# Altium schematic sheet 780-00055, rev1, Pg4, SCH, NRES Temp Meas, 8-Chan RTD .SchDoc
size B; PageSetup: Record=PageOptions|CenterHorizontal=True|CenterVertical=True|PrintScale=1.09|XCorrection=1.00|YCorrection=1.00|PrintKind=0|BorderSize=5000000|LeftOffset=0|BottomOffset=0|Orientation=2|PaperLength=1000|PaperWidth=1000|Scale=100|PaperSource=7|PrintQuality=-4|MediaType=1|DitherType=10|PaperKind=Ledger|PrintScaleMode=1
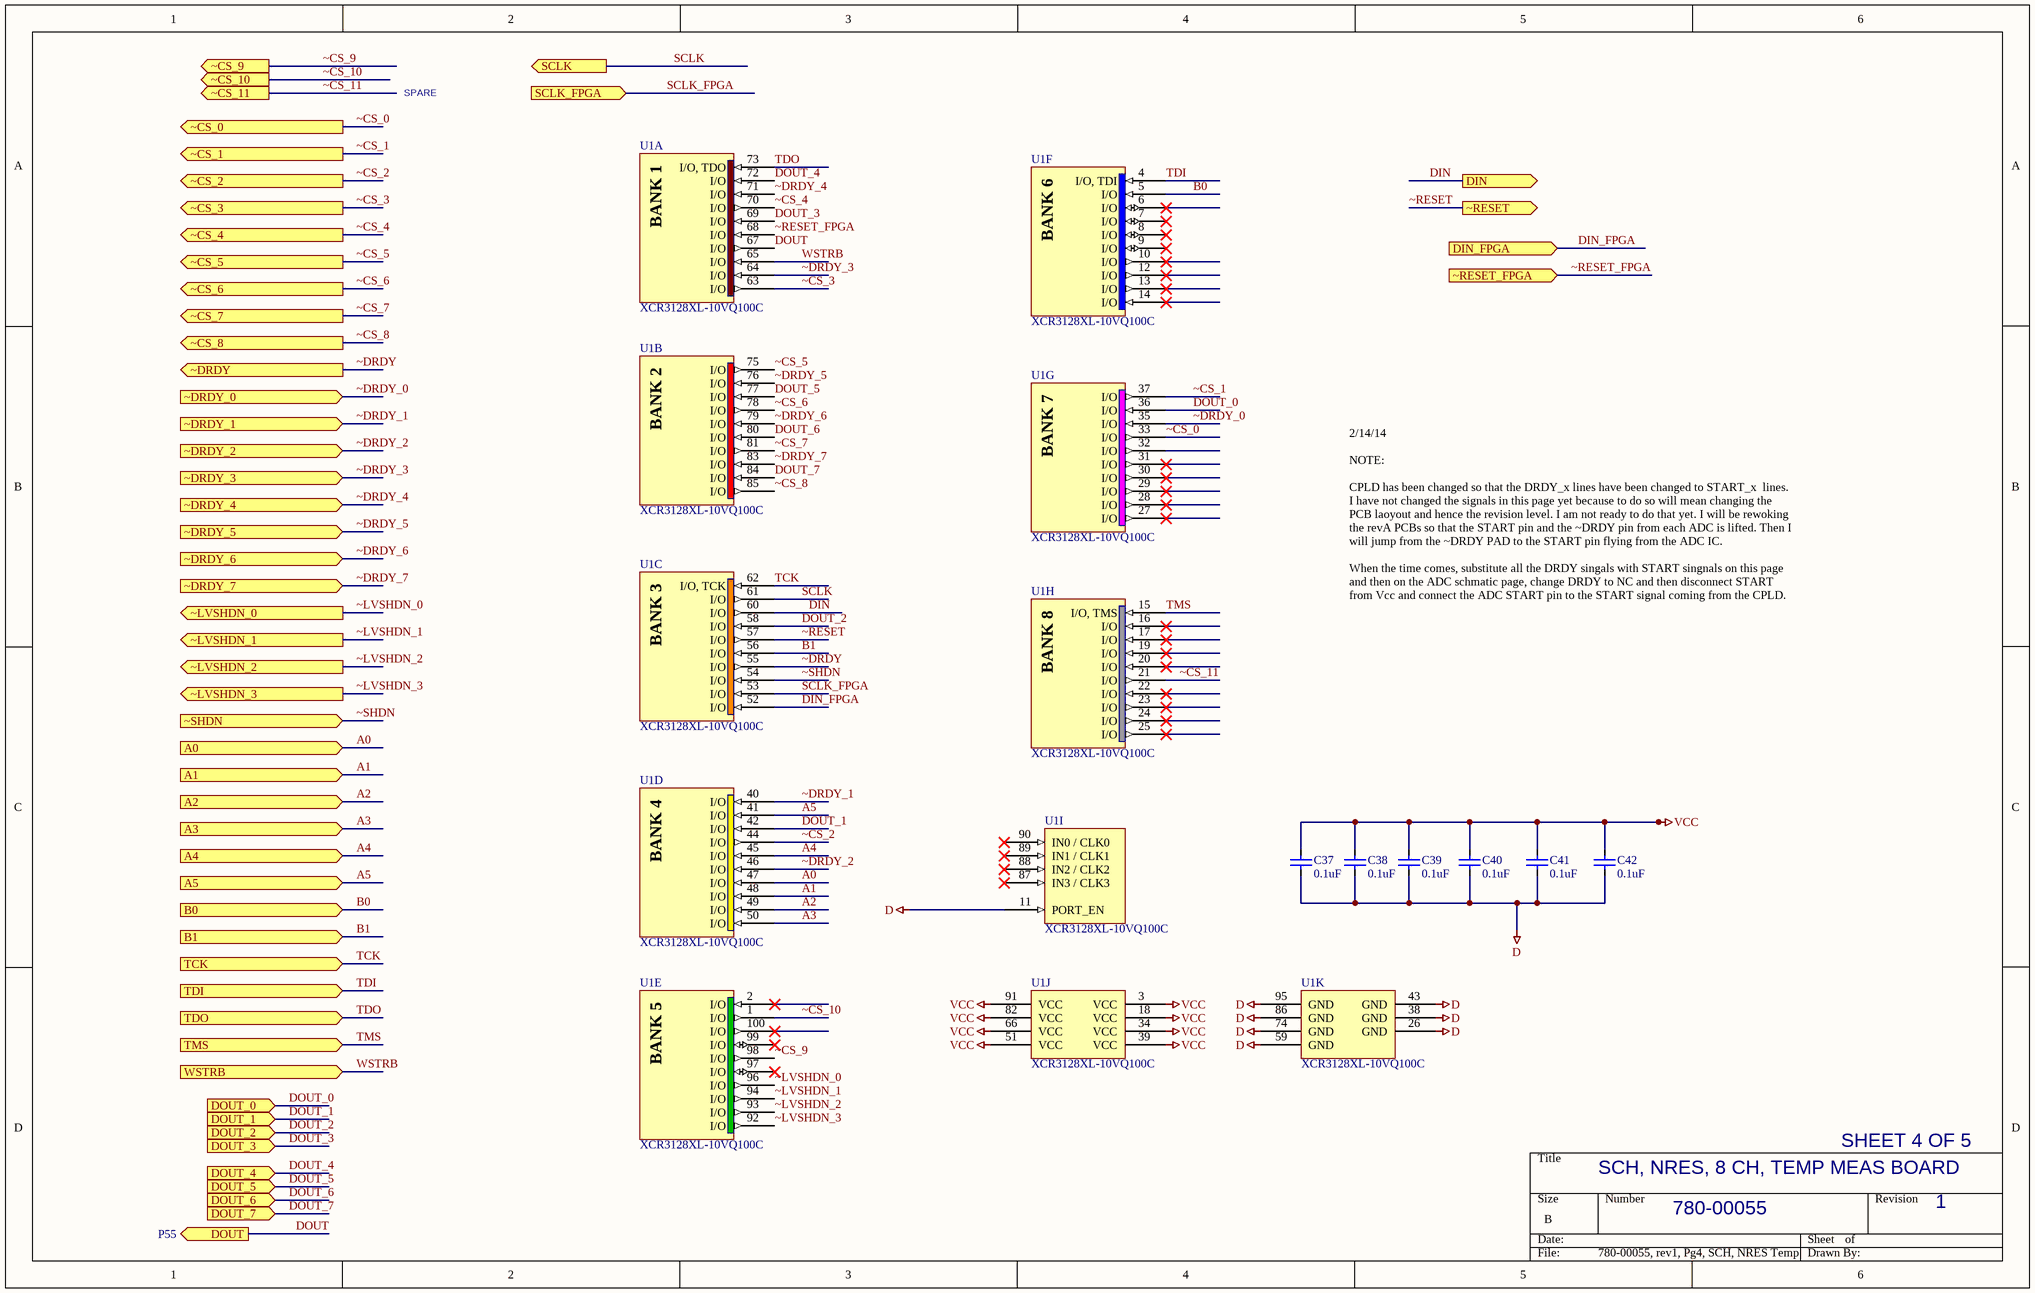
[diagram p0: 780-00055, rev1, Pg4, SCH, NRES Temp Meas, 8-Chan RTD .SchDoc]

## Parts
C37  value 0.1uF  [SMD_0805]  (hidden comment: Cap SMD)
C38  value 0.1uF  [SMD_0805]  (hidden comment: Cap SMD)
C39  value 0.1uF  [SMD_0805]  (hidden comment: Cap SMD)
C40  value 0.1uF  [SMD_0805]  (hidden comment: Cap SMD)
C41  value 0.1uF  [SMD_0805]  (hidden comment: Cap SMD)
C42  value 0.1uF  [SMD_0805]  (hidden comment: Cap SMD)
U1  XCR3128XL-10VQ100C  [VQ100_N]  (parts A,B,C,D,E,F,G,H,I,J,K of 11)

## Ports
A0 (in), A1 (in), A2 (in), A3 (in), A4 (in), A5 (in), B0 (in), B1 (in), DIN (out), DIN_FPGA (in), DOUT (out, see P55), DOUT_0 (in), DOUT_1 (in), DOUT_2 (in), DOUT_3 (in), DOUT_4 (in), DOUT_5 (in), DOUT_6 (in), DOUT_7 (in), SCLK (out), SCLK_FPGA (in), TCK (in), TDI (in), TDO (in), TMS (in), WSTRB (in), ~CS_0 (out), ~CS_1 (out), ~CS_2 (out), ~CS_3 (out), ~CS_4 (out), ~CS_5 (out), ~CS_6 (out), ~CS_7 (out), ~CS_8 (out), ~CS_9 (out), ~CS_10 (out), ~CS_11 (out), ~DRDY (out), ~DRDY_0 (in), ~DRDY_1 (in), ~DRDY_2 (in), ~DRDY_3 (in), ~DRDY_4 (in), ~DRDY_5 (in), ~DRDY_6 (in), ~DRDY_7 (in), ~LVSHDN_0 (out), ~LVSHDN_1 (out), ~LVSHDN_2 (out), ~LVSHDN_3 (out), ~RESET (out), ~RESET_FPGA (in), ~SHDN (in)

## Nets
D: C37.1 C38.1 C39.1 C40.1 C41.1 C42.1 U1.11(PORT_EN) U1.26(GND) U1.38(GND) U1.43(GND) U1.59(GND) U1.74(GND) U1.86(GND) U1.95(GND)
VCC: C37.2 C38.2 C39.2 C40.2 C41.2 C42.2 U1.3(VCC) U1.18(VCC) U1.34(VCC) U1.39(VCC) U1.51(VCC) U1.66(VCC) U1.82(VCC) U1.91(VCC)
A0: U1.47(I/O) ; port A0
A1: U1.48(I/O) ; port A1
A2: U1.49(I/O) ; port A2
A3: U1.50(I/O) ; port A3
A4: U1.45(I/O) ; port A4
A5: U1.41(I/O) ; port A5
B0: U1.5(I/O) ; port B0
B1: U1.56(I/O) ; port B1
DIN: U1.60(I/O) ; port DIN
DIN_FPGA: U1.52(I/O) ; port DIN_FPGA
DOUT: U1.67(I/O) ; port DOUT
DOUT_0: U1.36(I/O) ; port DOUT_0
DOUT_1: U1.42(I/O) ; port DOUT_1
DOUT_2: U1.58(I/O) ; port DOUT_2
DOUT_3: U1.69(I/O) ; port DOUT_3
DOUT_4: U1.72(I/O) ; port DOUT_4
DOUT_5: U1.77(I/O) ; port DOUT_5
DOUT_6: U1.80(I/O) ; port DOUT_6
DOUT_7: U1.84(I/O) ; port DOUT_7
SCLK: U1.61(I/O) ; port SCLK
SCLK_FPGA: U1.53(I/O) ; port SCLK_FPGA
TCK: U1.62(I/O,_TCK) ; port TCK
TDI: U1.4(I/O,_TDI) ; port TDI
TDO: U1.73(I/O,_TDO) ; port TDO
TMS: U1.15(I/O,_TMS) ; port TMS
WSTRB: U1.65(I/O) ; port WSTRB
~CS_0: U1.33(I/O) ; port ~CS_0
~CS_1: U1.37(I/O) ; port ~CS_1
~CS_2: U1.44(I/O) ; port ~CS_2
~CS_3: U1.63(I/O) ; port ~CS_3
~CS_4: U1.70(I/O) ; port ~CS_4
~CS_5: U1.75(I/O) ; port ~CS_5
~CS_6: U1.78(I/O) ; port ~CS_6
~CS_7: U1.81(I/O) ; port ~CS_7
~CS_8: U1.85(I/O) ; port ~CS_8
~CS_9: U1.98(I/O) ; port ~CS_9
~CS_10: U1.1(I/O) ; port ~CS_10
~CS_11: U1.21(I/O) ; port ~CS_11
~DRDY: U1.55(I/O) ; port ~DRDY
~DRDY_0: U1.35(I/O) ; port ~DRDY_0
~DRDY_1: U1.40(I/O) ; port ~DRDY_1
~DRDY_2: U1.46(I/O) ; port ~DRDY_2
~DRDY_3: U1.64(I/O) ; port ~DRDY_3
~DRDY_4: U1.71(I/O) ; port ~DRDY_4
~DRDY_5: U1.76(I/O) ; port ~DRDY_5
~DRDY_6: U1.79(I/O) ; port ~DRDY_6
~DRDY_7: U1.83(I/O) ; port ~DRDY_7
~LVSHDN_0: U1.96(I/O) ; port ~LVSHDN_0
~LVSHDN_1: U1.94(I/O) ; port ~LVSHDN_1
~LVSHDN_2: U1.93(I/O) ; port ~LVSHDN_2
~LVSHDN_3: U1.92(I/O) ; port ~LVSHDN_3
~RESET: U1.57(I/O) ; port ~RESET
~RESET_FPGA: U1.68(I/O) ; port ~RESET_FPGA
~SHDN: U1.54(I/O) ; port ~SHDN

Not connected (* = marked no-connect by the designer): U1 2(I/O)* 6(I/O)* 7(I/O)* 8(I/O)* 9(I/O)* 10(I/O)* 12(I/O)* 13(I/O)* 14(I/O)* 16(I/O)* 17(I/O)* 19(I/O)* 20(I/O)* 22(I/O)* 23(I/O)* 24(I/O)* 25(I/O)* 27(I/O)* 28(I/O)* 29(I/O)* 30(I/O)* 31(I/O)* 32(I/O) 87(IN3_/_CLK3)* 88(IN2_/_CLK2)* 89(IN1_/_CLK1)* 90(IN0_/_CLK0)* 97(I/O)* 99(I/O)* 100(I/O)*

## Notes on the sheet
- SPARE
- 2/14/14
  NOTE:
  CPLD has been changed so that the DRDY_x lines have been changed to START_x  lines. I have not changed the signals in this page yet because to do so will mean changing the PCB laoyout and hence the revision level. I am not ready to do that yet. I will be rewoking the revA PCBs so that the START pin and the ~DRDY pin from each ADC is lifted. Then I will jump from the ~DRDY PAD to the START pin flying from the ADC IC.
  When the time comes, substitute all the DRDY singals with START singnals on this page and then on the ADC schmatic page, change DRDY to NC and then disconnect START from Vcc and connect the ADC START pin to the START signal coming from the CPLD.
- SCH, NRES, 8 CH, TEMP MEAS BOARD
- SHEET 4 OF 5
- 780-00055
- 1
- (in symbol XCR3128XL-10VQ100C, part A) BANK 1
- (in symbol XCR3128XL-10VQ100C, part B) BANK 2
- (in symbol XCR3128XL-10VQ100C, part C) BANK 3
- (in symbol XCR3128XL-10VQ100C, part D) BANK 4
- (in symbol XCR3128XL-10VQ100C, part E) BANK 5
- (in symbol XCR3128XL-10VQ100C, part F) BANK 6
- (in symbol XCR3128XL-10VQ100C, part G) BANK 7
- (in symbol XCR3128XL-10VQ100C, part H) BANK 8

## Library data of the parts
C37-C42 = Cap SMD: Capacitor; Manufacturer: AVX; Manuf p/n: 08055C104KAT2A; Vendor: DigiKey; Vendor p/n: 478-1395-1-ND; Vendor Mult.: 10; LCO P/N: 120-00002; COST: 0.088
U1 = XCR3128XL-10VQ100C: CoolRunner XPLA3 3.3V, 128 Macrocell CPLD, 84 User I/Os, 100-Pin VQFP, Commercial Grade; LCO p/n: 150-00001